# Altium schematic sheet Power.SchDoc
size A3
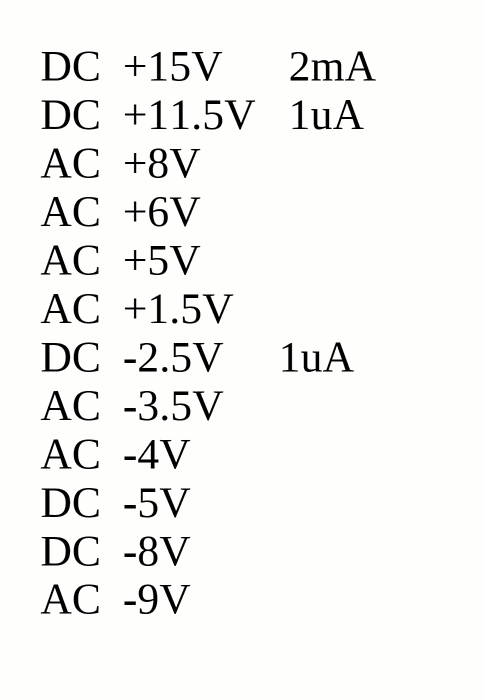
[diagram p0: Power.SchDoc]

## Notes on the sheet
- DC  +15V      2mA
  DC  +11.5V   1uA
  AC  +8V
  AC  +6V
  AC  +5V
  AC  +1.5V
  DC  -2.5V     1uA
  AC  -3.5V
  AC  -4V
  DC  -5V
  DC  -8V
  AC  -9V